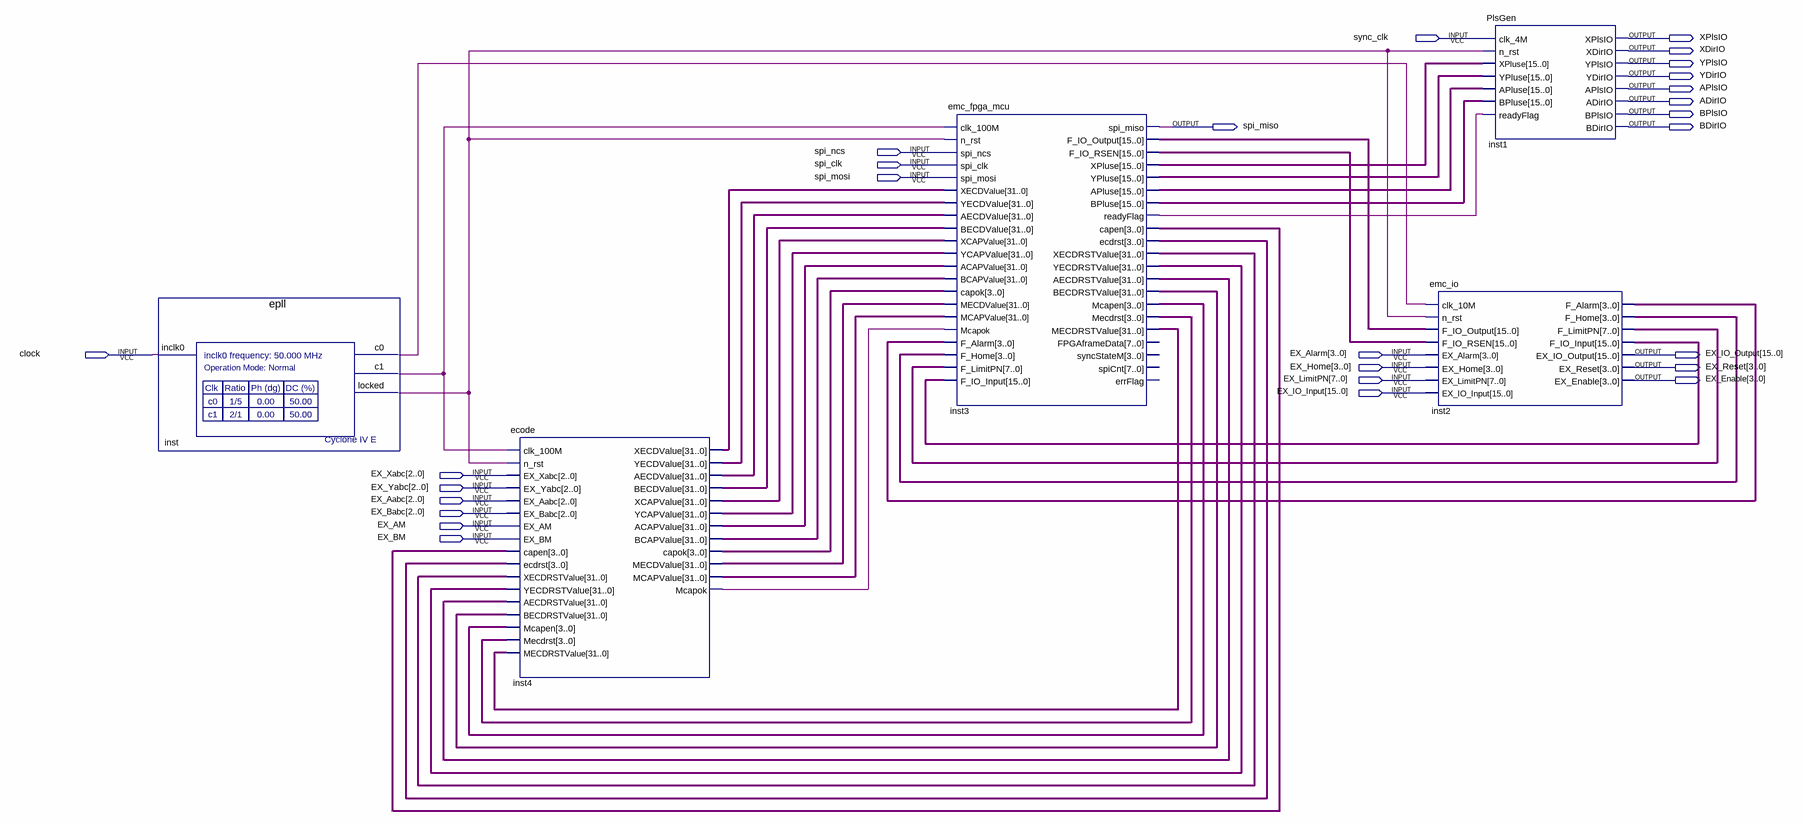
[diagram p0: schematic sheet]
// Quartus schematic emc.bdf as structural Verilog: 5 symbols, 27 pins
module emc (
  input  sync_clk,
  input  spi_ncs,
  input  spi_clk,
  input  spi_mosi,
  input  clock,
  input  [3:0] EX_Alarm,
  input  [3:0] EX_Home,
  input  [7:0] EX_LimitPN,
  input  [15:0] EX_IO_Input,
  input  [2:0] EX_Xabc,
  input  [2:0] EX_Yabc,
  input  [2:0] EX_Aabc,
  input  [2:0] EX_Babc,
  input  EX_AM,
  input  EX_BM,
  output XPlsIO,
  output XDirIO,
  output YPlsIO,
  output YDirIO,
  output APlsIO,
  output ADirIO,
  output BPlsIO,
  output spi_miso,
  output BDirIO,
  output [15:0] EX_IO_Output,
  output [3:0] EX_Reset,
  output [3:0] EX_Enable
);

  wire inst3_readyflag, inst4_mcapok, inst_c0, inst_c1, inst_locked;
  wire [3:0] inst2_f_alarm, inst2_f_home, inst3_capen, inst3_ecdrst, inst3_mcapen, inst3_mecdrst, inst4_capok;
  wire [7:0] inst2_f_limitpn;
  wire [15:0] inst2_f_io_input, inst3_apluse, inst3_bpluse, inst3_f_io_output, inst3_f_io_rsen, inst3_xpluse,
       inst3_ypluse;
  wire [31:0] inst3_aecdrstvalue, inst3_becdrstvalue, inst3_mecdrstvalue, inst3_xecdrstvalue,
       inst3_yecdrstvalue, inst4_acapvalue, inst4_aecdvalue, inst4_bcapvalue, inst4_becdvalue,
       inst4_mcapvalue, inst4_mecdvalue, inst4_xcapvalue, inst4_xecdvalue, inst4_ycapvalue, inst4_yecdvalue;

  epll inst (.inclk0(clock), .c0(inst_c0), .c1(inst_c1), .locked(inst_locked));
  ecode inst4 (
    .clk_100M(inst_c1), .n_rst(inst_locked), .EX_Xabc(EX_Xabc), .EX_Yabc(EX_Yabc), .EX_Aabc(EX_Aabc),
    .EX_Babc(EX_Babc), .EX_AM(EX_AM), .EX_BM(EX_BM), .capen(inst3_capen), .ecdrst(inst3_ecdrst),
    .XECDRSTValue(inst3_xecdrstvalue), .YECDRSTValue(inst3_yecdrstvalue), .AECDRSTValue(inst3_aecdrstvalue),
    .BECDRSTValue(inst3_becdrstvalue), .Mcapen(inst3_mcapen), .Mecdrst(inst3_mecdrst),
    .MECDRSTValue(inst3_mecdrstvalue), .XECDValue(inst4_xecdvalue), .YECDValue(inst4_yecdvalue),
    .AECDValue(inst4_aecdvalue), .BECDValue(inst4_becdvalue), .XCAPValue(inst4_xcapvalue),
    .YCAPValue(inst4_ycapvalue), .ACAPValue(inst4_acapvalue), .BCAPValue(inst4_bcapvalue),
    .capok(inst4_capok), .MECDValue(inst4_mecdvalue), .MCAPValue(inst4_mcapvalue), .Mcapok(inst4_mcapok));
  emc_fpga_mcu inst3 (
    .clk_100M(inst_c1), .n_rst(inst_locked), .spi_ncs(spi_ncs), .spi_clk(spi_clk), .spi_mosi(spi_mosi),
    .XECDValue(inst4_xecdvalue), .YECDValue(inst4_yecdvalue), .AECDValue(inst4_aecdvalue),
    .BECDValue(inst4_becdvalue), .XCAPValue(inst4_xcapvalue), .YCAPValue(inst4_ycapvalue),
    .ACAPValue(inst4_acapvalue), .BCAPValue(inst4_bcapvalue), .capok(inst4_capok),
    .MECDValue(inst4_mecdvalue), .MCAPValue(inst4_mcapvalue), .Mcapok(inst4_mcapok), .F_Alarm(inst2_f_alarm),
    .F_Home(inst2_f_home), .F_LimitPN(inst2_f_limitpn), .F_IO_Input(inst2_f_io_input), .spi_miso(spi_miso),
    .F_IO_Output(inst3_f_io_output), .F_IO_RSEN(inst3_f_io_rsen), .XPluse(inst3_xpluse),
    .YPluse(inst3_ypluse), .APluse(inst3_apluse), .BPluse(inst3_bpluse), .readyFlag(inst3_readyflag),
    .capen(inst3_capen), .ecdrst(inst3_ecdrst), .XECDRSTValue(inst3_xecdrstvalue),
    .YECDRSTValue(inst3_yecdrstvalue), .AECDRSTValue(inst3_aecdrstvalue), .BECDRSTValue(inst3_becdrstvalue),
    .Mcapen(inst3_mcapen), .Mecdrst(inst3_mecdrst), .MECDRSTValue(inst3_mecdrstvalue));  // open: FPGAframeData, syncStateM, spiCnt, errFlag
  emc_io inst2 (
    .clk_10M(inst_c0), .n_rst(inst_locked), .F_IO_Output(inst3_f_io_output), .F_IO_RSEN(inst3_f_io_rsen),
    .EX_Alarm(EX_Alarm), .EX_Home(EX_Home), .EX_LimitPN(EX_LimitPN), .EX_IO_Input(EX_IO_Input),
    .F_Alarm(inst2_f_alarm), .F_Home(inst2_f_home), .F_LimitPN(inst2_f_limitpn),
    .F_IO_Input(inst2_f_io_input), .EX_IO_Output(EX_IO_Output), .EX_Reset(EX_Reset), .EX_Enable(EX_Enable));
  PlsGen inst1 (
    .clk_4M(sync_clk), .n_rst(inst_locked), .XPluse(inst3_xpluse), .YPluse(inst3_ypluse),
    .APluse(inst3_apluse), .BPluse(inst3_bpluse), .readyFlag(inst3_readyflag), .XPlsIO(XPlsIO),
    .XDirIO(XDirIO), .YPlsIO(YPlsIO), .YDirIO(YDirIO), .APlsIO(APlsIO), .ADirIO(ADirIO), .BPlsIO(BPlsIO),
    .BDirIO(BDirIO));
endmodule
